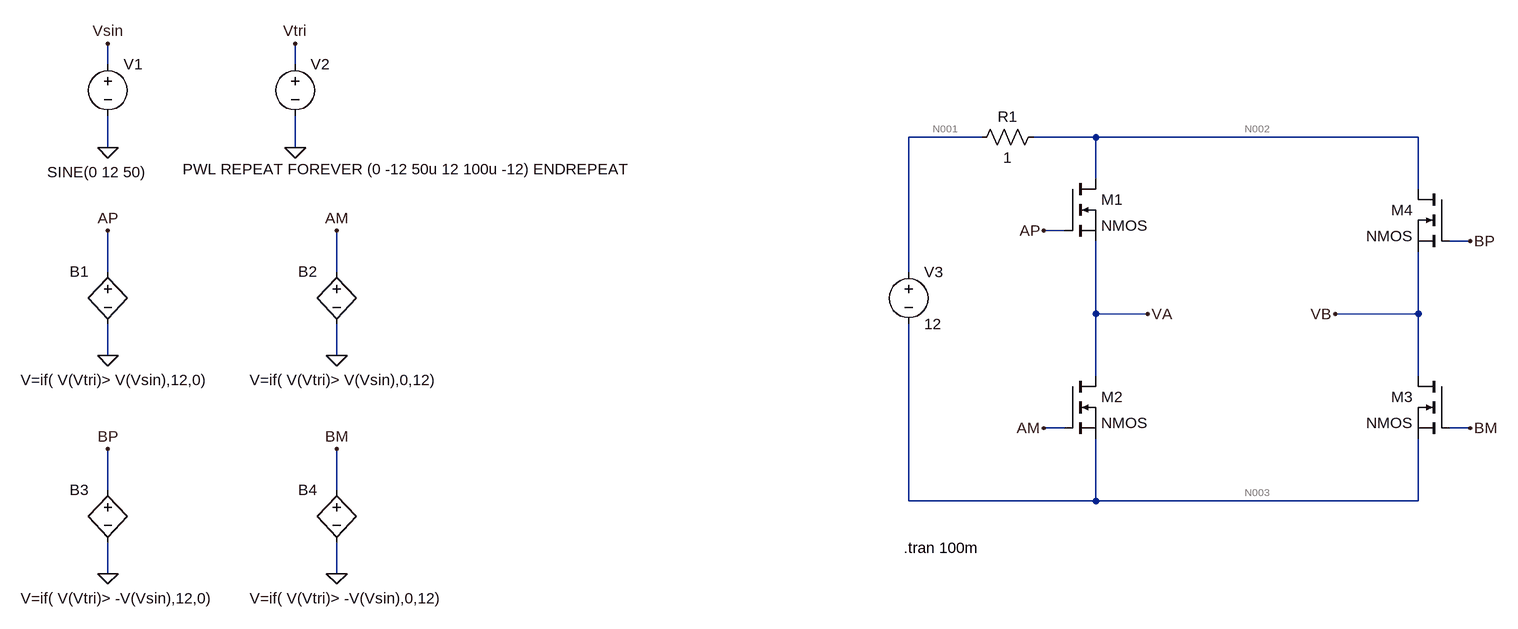
[diagram p0: schematic puenteHconSPWM_NMOS_IDEAL.asc]
puenteHconSPWM_NMOS_IDEAL.asc, the LTspice schematic file:
Version 4
SHEET 1 1076 680
WIRE -2432 -560 -2432 -592
WIRE -2144 -560 -2144 -592
WIRE -1088 -448 -1200 -448
WIRE -912 -448 -1008 -448
WIRE -416 -448 -912 -448
WIRE -2432 -432 -2432 -480
WIRE -2144 -432 -2144 -480
WIRE -912 -384 -912 -448
WIRE -416 -368 -416 -448
WIRE -960 -304 -992 -304
WIRE -336 -288 -368 -288
WIRE -2432 -240 -2432 -304
WIRE -2080 -240 -2080 -304
WIRE -1200 -240 -1200 -448
WIRE -912 -176 -912 -288
WIRE -832 -176 -912 -176
WIRE -416 -176 -416 -272
WIRE -416 -176 -544 -176
WIRE -2432 -112 -2432 -160
WIRE -2080 -112 -2080 -160
WIRE -912 -80 -912 -176
WIRE -416 -80 -416 -176
WIRE -960 0 -992 0
WIRE -336 0 -368 0
WIRE -2432 96 -2432 32
WIRE -2080 96 -2080 32
WIRE -1200 112 -1200 -160
WIRE -912 112 -912 16
WIRE -912 112 -1200 112
WIRE -416 112 -416 16
WIRE -416 112 -912 112
WIRE -2432 224 -2432 176
WIRE -2080 224 -2080 176
FLAG -2432 -432 0
FLAG -2144 -432 0
FLAG -2432 -592 Vsin
FLAG -2144 -592 Vtri
FLAG -2432 -112 0
FLAG -2080 -112 0
FLAG -2432 -304 AP
FLAG -2080 -304 AM
FLAG -2432 224 0
FLAG -2080 224 0
FLAG -2432 32 BP
FLAG -2080 32 BM
FLAG -992 -304 AP
FLAG -992 0 AM
FLAG -336 0 BM
FLAG -336 -288 BP
FLAG -832 -176 VA
FLAG -544 -176 VB
SYMBOL voltage -2432 -576 R0
WINDOW 3 -93 182 Left 2
WINDOW 123 0 0 Left 0
WINDOW 39 0 0 Left 0
SYMATTR Value SINE(0 12 50)
SYMATTR InstName V1
SYMBOL voltage -2144 -576 R0
WINDOW 3 -173 177 Left 2
SYMATTR Value PWL REPEAT FOREVER (0 -12 50u 12 100u -12) ENDREPEAT
SYMATTR InstName V2
SYMATTR Prefix ""
SYMBOL bv -2432 -256 R0
WINDOW 0 -59 15 Left 2
WINDOW 3 -134 182 Left 2
SYMATTR InstName B1
SYMATTR Value V=if( V(Vtri)> V(Vsin),12,0)
SYMBOL bv -2080 -256 R0
WINDOW 0 -59 15 Left 2
WINDOW 3 -134 182 Left 2
SYMATTR InstName B2
SYMATTR Value V=if( V(Vtri)> V(Vsin),0,12)
SYMBOL bv -2432 80 R0
WINDOW 0 -59 15 Left 2
WINDOW 3 -134 182 Left 2
SYMATTR InstName B3
SYMATTR Value V=if( V(Vtri)> -V(Vsin),12,0)
SYMBOL bv -2080 80 R0
WINDOW 0 -59 15 Left 2
WINDOW 3 -134 182 Left 2
SYMATTR InstName B4
SYMATTR Value V=if( V(Vtri)> -V(Vsin),0,12)
SYMBOL nmos -960 -384 R0
SYMATTR InstName M1
SYMBOL nmos -960 -80 R0
SYMATTR InstName M2
SYMBOL nmos -368 -80 M0
SYMATTR InstName M3
SYMBOL nmos -368 -368 M0
SYMATTR InstName M4
SYMBOL voltage -1200 -256 R0
WINDOW 123 0 0 Left 0
WINDOW 39 0 0 Left 0
SYMATTR InstName V3
SYMATTR Value 12
SYMBOL res -992 -464 R90
WINDOW 0 0 56 VBottom 2
WINDOW 3 32 56 VTop 2
SYMATTR InstName R1
SYMATTR Value 1
TEXT -1208 184 Left 2 !.tran 100m

The netlist it stands for:
* puenteHconSPWM_NMOS_IDEAL.asc
V1 Vsin 0 SINE(0 12 50)
XV2 Vtri 0 PWL REPEAT FOREVER (0 -12 50u 12 100u -12) ENDREPEAT  ; pins + -
B1 AP 0 V=if( V(Vtri)> V(Vsin),12,0)
B2 AM 0 V=if( V(Vtri)> V(Vsin),0,12)
B3 BP 0 V=if( V(Vtri)> -V(Vsin),12,0)
B4 BM 0 V=if( V(Vtri)> -V(Vsin),0,12)
M1 N002 AP VA VA NMOS
M2 VA AM N003 N003 NMOS
M3 VB BM N003 N003 NMOS
M4 N002 BP VB VB NMOS
V3 N001 N003 12
R1 N002 N001 1
.model NMOS NMOS
.model PMOS PMOS
.lib standard.mos
.tran 100m
.backanno
.end

* Results of the author's LTspice run, read from the files saved beside the schematic
* Operating Point, zero values left out:
*   V(vtri) = -12 V
*   V(am) = 12 V
*   V(bm) = 12 V
*   V(n002) = -1.949 mV
*   V(va) = -9.875 V
*   V(n003) = -12 V
*   V(vb) = -9.875 V
*   V(n001) = 1.085 µV
*   Id(M1) = 975.1 µA
*   Ib(M1) = -9.883 pA
*   Is(M1) = -975.1 µA
*   Id(M2) = 975.1 µA
*   Ib(M2) = -2.135 pA
*   Is(M2) = -975.1 µA
*   Id(M3) = 975.1 µA
*   Ib(M3) = -2.135 pA
*   Is(M3) = -975.1 µA
*   Id(M4) = 975.1 µA
*   Ib(M4) = -9.883 pA
*   Is(M4) = -975.1 µA
*   I(R1) = -1.95 mA
*   I(V3) = -1.95 mA
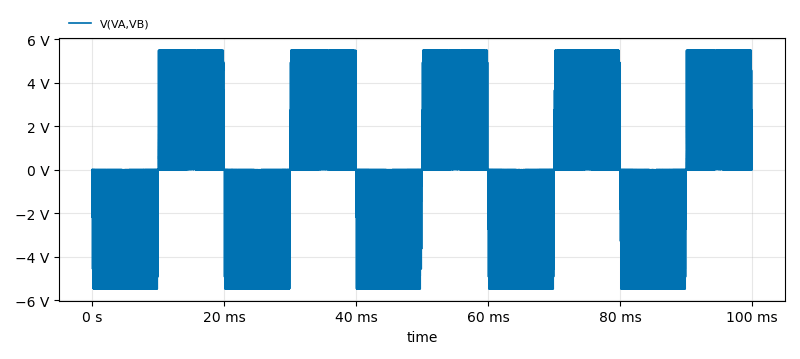
[diagram p1: Transient Analysis of puenteHconSPWM_NMOS_IDEAL.asc, plotted from the saved traces]
* Transient Analysis, 1 run:
*   V(VA,VB): min -5.482 V, max 5.482 V, average -818.1 µV, rms 4.321 V, last 0 V